# Altium schematic sheet LED_2.SchDoc
size A4; SheetNumber: 5; SheetTotal: 5
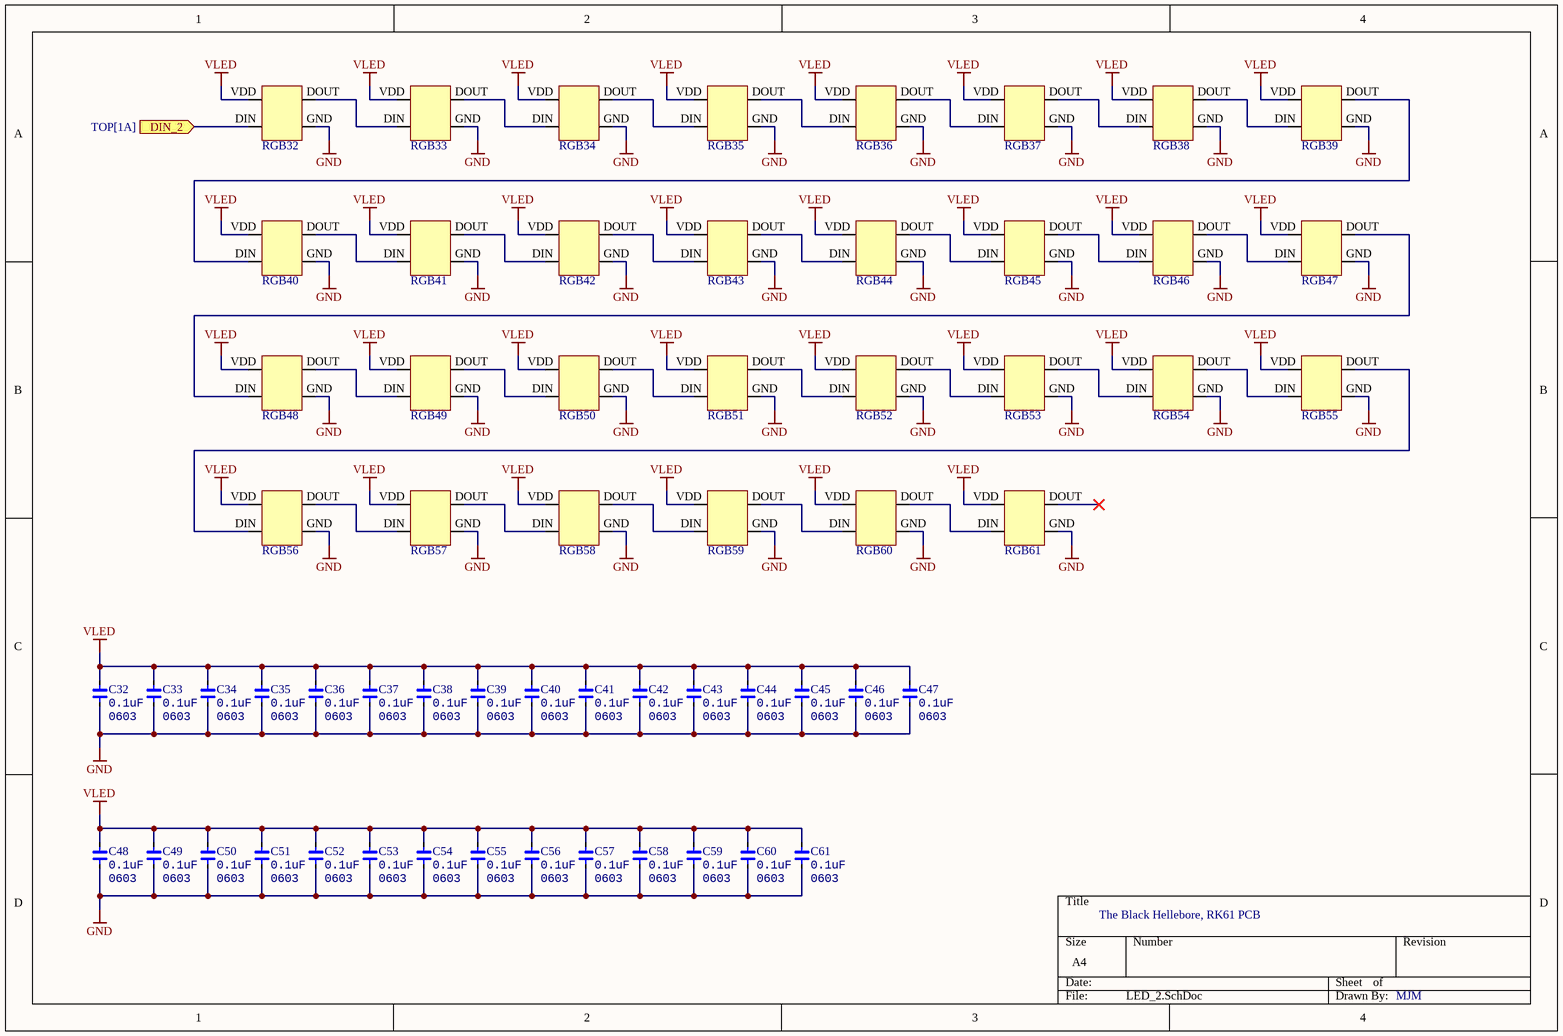
[diagram p0: LED_2.SchDoc]

## Parts
C32  value 0.1uF  Type: 0603  [FP-CC0603-DA-MFG]  (hidden comment: CC0603JRX7R9BB104)
C33  value 0.1uF  Type: 0603  [FP-CC0603-DA-MFG]  (hidden comment: CC0603JRX7R9BB104)
C34  value 0.1uF  Type: 0603  [FP-CC0603-DA-MFG]  (hidden comment: CC0603JRX7R9BB104)
C35  value 0.1uF  Type: 0603  [FP-CC0603-DA-MFG]  (hidden comment: CC0603JRX7R9BB104)
C36  value 0.1uF  Type: 0603  [FP-CC0603-DA-MFG]  (hidden comment: CC0603JRX7R9BB104)
C37  value 0.1uF  Type: 0603  [FP-CC0603-DA-MFG]  (hidden comment: CC0603JRX7R9BB104)
C38  value 0.1uF  Type: 0603  [FP-CC0603-DA-MFG]  (hidden comment: CC0603JRX7R9BB104)
C39  value 0.1uF  Type: 0603  [FP-CC0603-DA-MFG]  (hidden comment: CC0603JRX7R9BB104)
C40  value 0.1uF  Type: 0603  [FP-CC0603-DA-MFG]  (hidden comment: CC0603JRX7R9BB104)
C41  value 0.1uF  Type: 0603  [FP-CC0603-DA-MFG]  (hidden comment: CC0603JRX7R9BB104)
C42  value 0.1uF  Type: 0603  [FP-CC0603-DA-MFG]  (hidden comment: CC0603JRX7R9BB104)
C43  value 0.1uF  Type: 0603  [FP-CC0603-DA-MFG]  (hidden comment: CC0603JRX7R9BB104)
C44  value 0.1uF  Type: 0603  [FP-CC0603-DA-MFG]  (hidden comment: CC0603JRX7R9BB104)
C45  value 0.1uF  Type: 0603  [FP-CC0603-DA-MFG]  (hidden comment: CC0603JRX7R9BB104)
C46  value 0.1uF  Type: 0603  [FP-CC0603-DA-MFG]  (hidden comment: CC0603JRX7R9BB104)
C47  value 0.1uF  Type: 0603  [FP-CC0603-DA-MFG]  (hidden comment: CC0603JRX7R9BB104)
C48  value 0.1uF  Type: 0603  [FP-CC0603-DA-MFG]  (hidden comment: CC0603JRX7R9BB104)
C49  value 0.1uF  Type: 0603  [FP-CC0603-DA-MFG]  (hidden comment: CC0603JRX7R9BB104)
C50  value 0.1uF  Type: 0603  [FP-CC0603-DA-MFG]  (hidden comment: CC0603JRX7R9BB104)
C51  value 0.1uF  Type: 0603  [FP-CC0603-DA-MFG]  (hidden comment: CC0603JRX7R9BB104)
C52  value 0.1uF  Type: 0603  [FP-CC0603-DA-MFG]  (hidden comment: CC0603JRX7R9BB104)
C53  value 0.1uF  Type: 0603  [FP-CC0603-DA-MFG]  (hidden comment: CC0603JRX7R9BB104)
C54  value 0.1uF  Type: 0603  [FP-CC0603-DA-MFG]  (hidden comment: CC0603JRX7R9BB104)
C55  value 0.1uF  Type: 0603  [FP-CC0603-DA-MFG]  (hidden comment: CC0603JRX7R9BB104)
C56  value 0.1uF  Type: 0603  [FP-CC0603-DA-MFG]  (hidden comment: CC0603JRX7R9BB104)
C57  value 0.1uF  Type: 0603  [FP-CC0603-DA-MFG]  (hidden comment: CC0603JRX7R9BB104)
C58  value 0.1uF  Type: 0603  [FP-CC0603-DA-MFG]  (hidden comment: CC0603JRX7R9BB104)
C59  value 0.1uF  Type: 0603  [FP-CC0603-DA-MFG]  (hidden comment: CC0603JRX7R9BB104)
C60  value 0.1uF  Type: 0603  [FP-CC0603-DA-MFG]  (hidden comment: CC0603JRX7R9BB104)
C61  value 0.1uF  Type: 0603  [FP-CC0603-DA-MFG]  (hidden comment: CC0603JRX7R9BB104)
RGB32  SK6812MINI-E  [sk6812minie]  (value not drawn)
RGB33  SK6812MINI-E  [sk6812minie]  (value not drawn)
RGB34  SK6812MINI-E  [sk6812minie]  (value not drawn)
RGB35  SK6812MINI-E  [sk6812minie]  (value not drawn)
RGB36  SK6812MINI-E  [sk6812minie]  (value not drawn)
RGB37  SK6812MINI-E  [sk6812minie]  (value not drawn)
RGB38  SK6812MINI-E  [sk6812minie]  (value not drawn)
RGB39  SK6812MINI-E  [sk6812minie]  (value not drawn)
RGB40  SK6812MINI-E  [sk6812minie]  (value not drawn)
RGB41  SK6812MINI-E  [sk6812minie]  (value not drawn)
RGB42  SK6812MINI-E  [sk6812minie]  (value not drawn)
RGB43  SK6812MINI-E  [sk6812minie]  (value not drawn)
RGB44  SK6812MINI-E  [sk6812minie]  (value not drawn)
RGB45  SK6812MINI-E  [sk6812minie]  (value not drawn)
RGB46  SK6812MINI-E  [sk6812minie]  (value not drawn)
RGB47  SK6812MINI-E  [sk6812minie]  (value not drawn)
RGB48  SK6812MINI-E  [sk6812minie]  (value not drawn)
RGB49  SK6812MINI-E  [sk6812minie]  (value not drawn)
RGB50  SK6812MINI-E  [sk6812minie]  (value not drawn)
RGB51  SK6812MINI-E  [sk6812minie]  (value not drawn)
RGB52  SK6812MINI-E  [sk6812minie]  (value not drawn)
RGB53  SK6812MINI-E  [sk6812minie]  (value not drawn)
RGB54  SK6812MINI-E  [sk6812minie]  (value not drawn)
RGB55  SK6812MINI-E  [sk6812minie]  (value not drawn)
RGB56  SK6812MINI-E  [sk6812minie]  (value not drawn)
RGB57  SK6812MINI-E  [sk6812minie]  (value not drawn)
RGB58  SK6812MINI-E  [sk6812minie]  (value not drawn)
RGB59  SK6812MINI-E  [sk6812minie]  (value not drawn)
RGB60  SK6812MINI-E  [sk6812minie]  (value not drawn)
RGB61  SK6812MINI-E  [sk6812minie]  (value not drawn)

## Ports
DIN_2 (in, see TOP[1A])

## Nets
GND: C32.1 C33.1 C34.1 C35.1 C36.1 C37.1 C38.1 C39.1 C40.1 C41.1 C42.1 C43.1 C44.1 C45.1 C46.1 C47.1 C48.1 C49.1 C50.1 C51.1 C52.1 C53.1 C54.1 C55.1 C56.1 C57.1 C58.1 C59.1 C60.1 C61.1 RGB32.GND RGB33.GND RGB34.GND RGB35.GND RGB36.GND RGB37.GND RGB38.GND RGB39.GND RGB40.GND RGB41.GND RGB42.GND RGB43.GND RGB44.GND RGB45.GND RGB46.GND RGB47.GND RGB48.GND RGB49.GND RGB50.GND RGB51.GND RGB52.GND RGB53.GND RGB54.GND RGB55.GND RGB56.GND RGB57.GND RGB58.GND RGB59.GND RGB60.GND RGB61.GND
VLED: C32.2 C33.2 C34.2 C35.2 C36.2 C37.2 C38.2 C39.2 C40.2 C41.2 C42.2 C43.2 C44.2 C45.2 C46.2 C47.2 C48.2 C49.2 C50.2 C51.2 C52.2 C53.2 C54.2 C55.2 C56.2 C57.2 C58.2 C59.2 C60.2 C61.2 RGB32.VDD RGB33.VDD RGB34.VDD RGB35.VDD RGB36.VDD RGB37.VDD RGB38.VDD RGB39.VDD RGB40.VDD RGB41.VDD RGB42.VDD RGB43.VDD RGB44.VDD RGB45.VDD RGB46.VDD RGB47.VDD RGB48.VDD RGB49.VDD RGB50.VDD RGB51.VDD RGB52.VDD RGB53.VDD RGB54.VDD RGB55.VDD RGB56.VDD RGB57.VDD RGB58.VDD RGB59.VDD RGB60.VDD RGB61.VDD
DIN_2: RGB32.DIN ; port DIN_2
NetRGB32_DOUT: RGB32.DOUT RGB33.DIN
NetRGB33_DOUT: RGB33.DOUT RGB34.DIN
NetRGB34_DOUT: RGB34.DOUT RGB35.DIN
NetRGB35_DOUT: RGB35.DOUT RGB36.DIN
NetRGB36_DOUT: RGB36.DOUT RGB37.DIN
NetRGB37_DOUT: RGB37.DOUT RGB38.DIN
NetRGB38_DOUT: RGB38.DOUT RGB39.DIN
NetRGB39_DOUT: RGB39.DOUT RGB40.DIN
NetRGB40_DOUT: RGB40.DOUT RGB41.DIN
NetRGB41_DOUT: RGB41.DOUT RGB42.DIN
NetRGB42_DOUT: RGB42.DOUT RGB43.DIN
NetRGB43_DOUT: RGB43.DOUT RGB44.DIN
NetRGB44_DOUT: RGB44.DOUT RGB45.DIN
NetRGB45_DOUT: RGB45.DOUT RGB46.DIN
NetRGB46_DOUT: RGB46.DOUT RGB47.DIN
NetRGB47_DOUT: RGB47.DOUT RGB48.DIN
NetRGB48_DOUT: RGB48.DOUT RGB49.DIN
NetRGB49_DOUT: RGB49.DOUT RGB50.DIN
NetRGB50_DOUT: RGB50.DOUT RGB51.DIN
NetRGB51_DOUT: RGB51.DOUT RGB52.DIN
NetRGB52_DOUT: RGB52.DOUT RGB53.DIN
NetRGB53_DOUT: RGB53.DOUT RGB54.DIN
NetRGB54_DOUT: RGB54.DOUT RGB55.DIN
NetRGB55_DOUT: RGB55.DOUT RGB56.DIN
NetRGB56_DOUT: RGB56.DOUT RGB57.DIN
NetRGB57_DOUT: RGB57.DOUT RGB58.DIN
NetRGB58_DOUT: RGB58.DOUT RGB59.DIN
NetRGB59_DOUT: RGB59.DOUT RGB60.DIN
NetRGB60_DOUT: RGB60.DOUT RGB61.DIN

Not connected (* = marked no-connect by the designer): RGB61 DOUT*

## Notes on the sheet
- The Black Hellebore, RK61 PCB
- MJM

## Library data of the parts
C32-C61 = CMP-004-000009-6: 0603 0.1 uF 50 V ±5 % Tolerance X7R SMT Multilayer Ceramic Capacitor
RGB32-RGB61 = CMP-00002-18: RGB LED SK6812MINI-E; Source: SK6812MINI-E.SchLib; Design Item ID: SK6812MINI-E; Component Type: Standard; Pin Count: 4